# EasyEDA Pro project 搞机小队_v1.1.3.eprj, board 机身
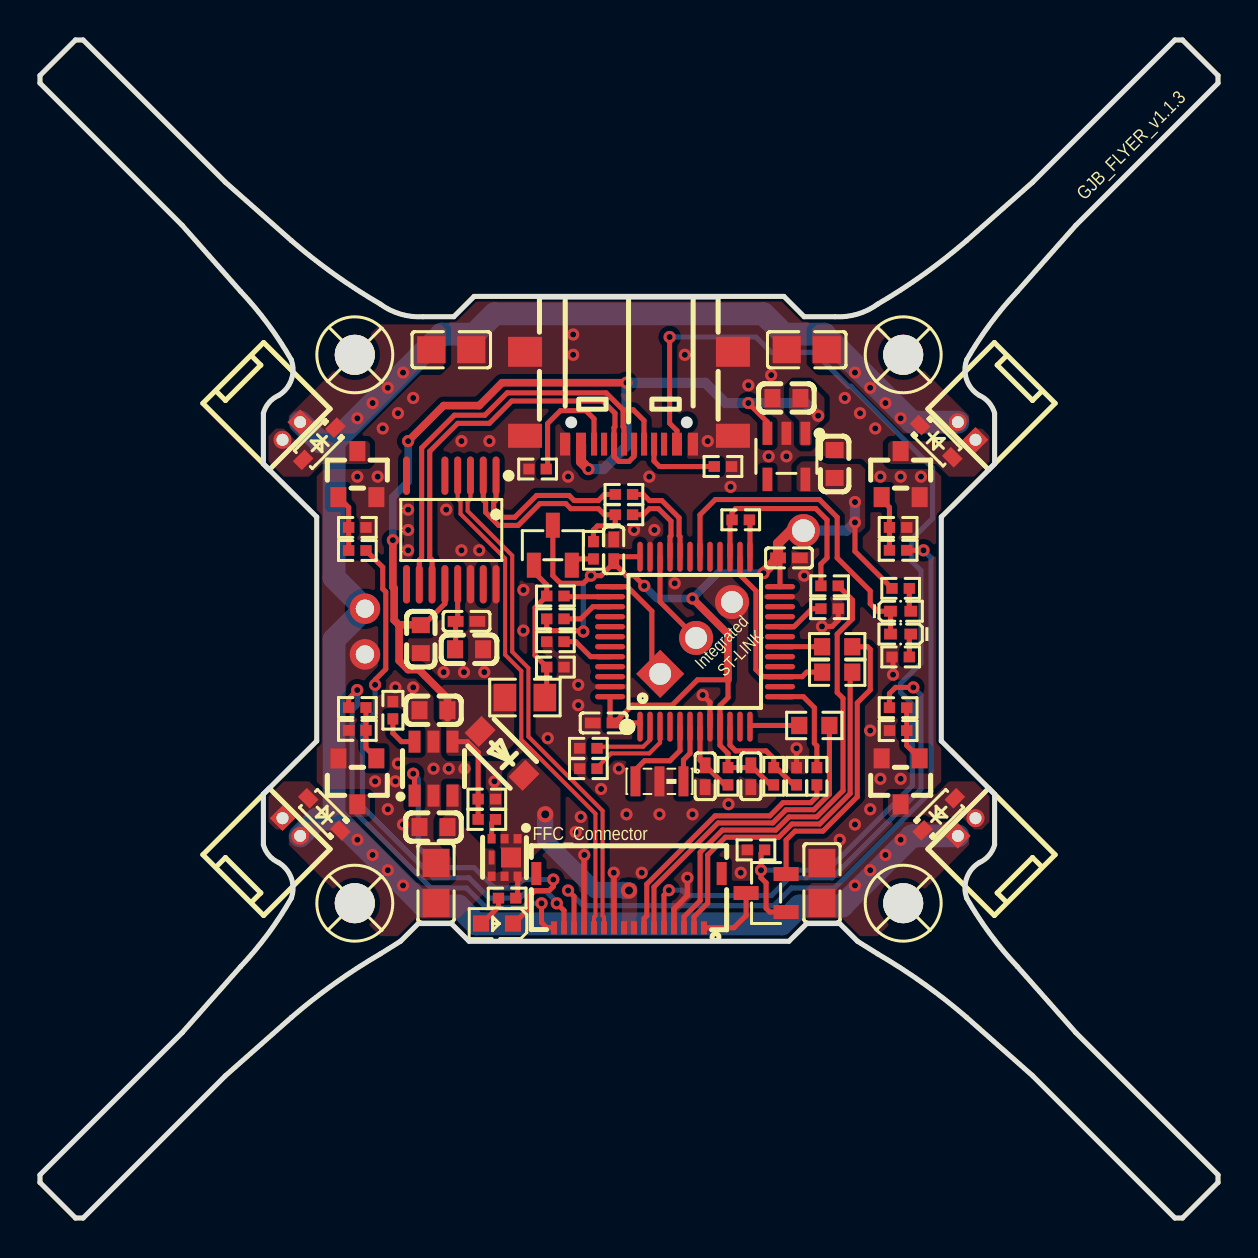
[diagram p6: board, top side]
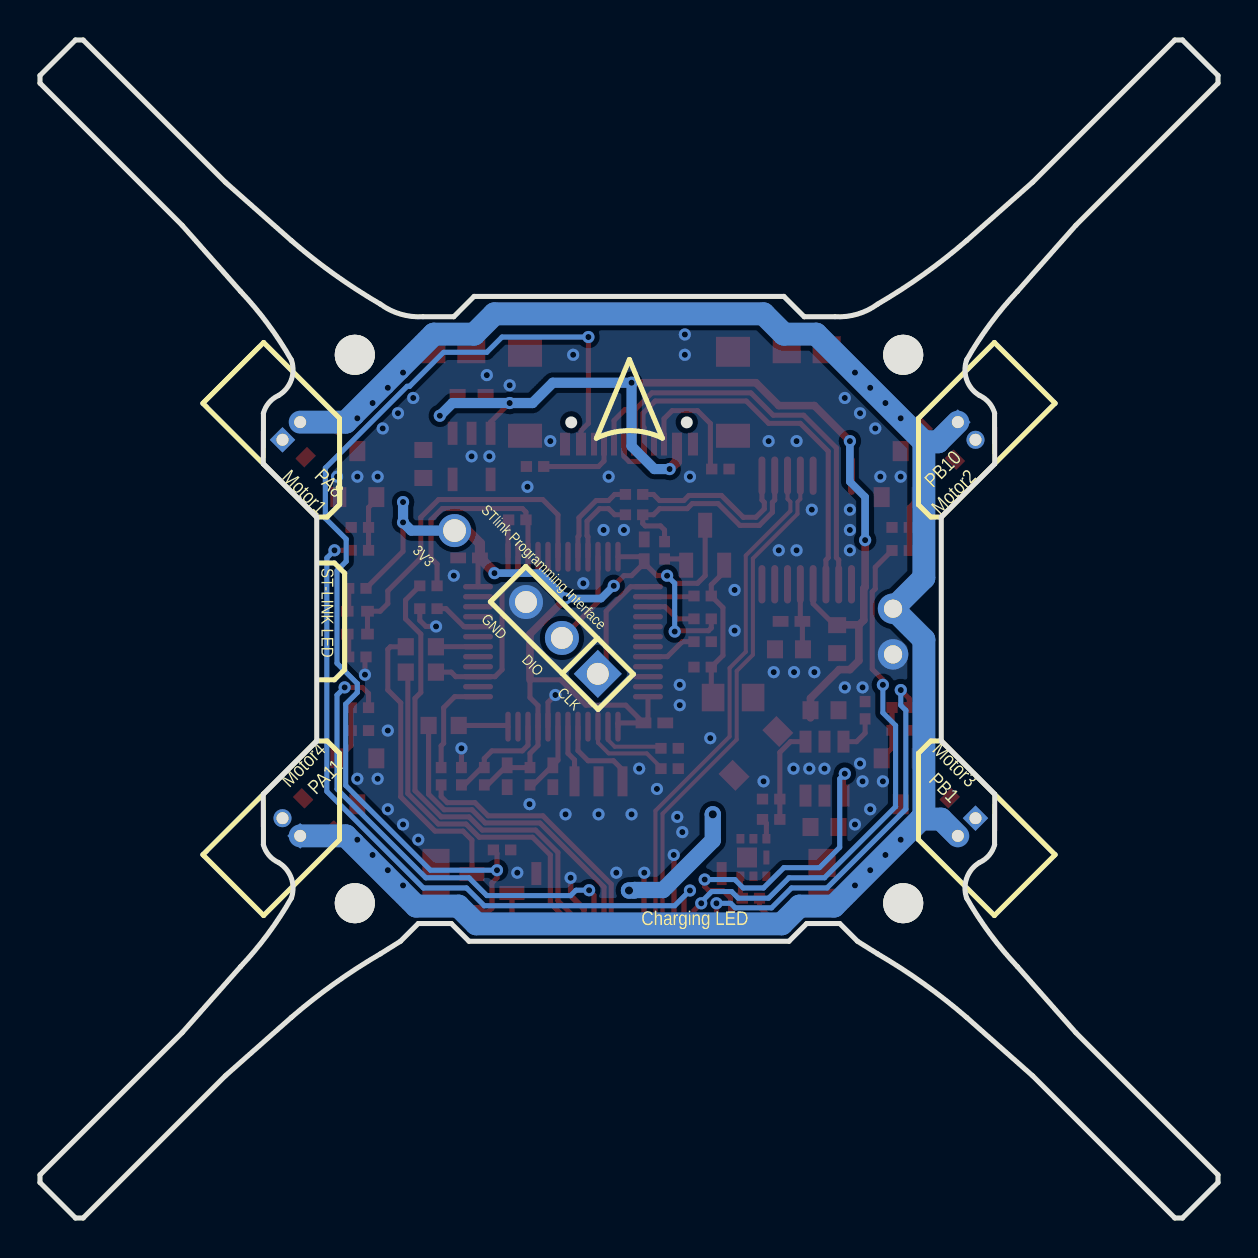
[diagram p7: board, bottom side, seen from below]

Outline 58.93 x 58.93 mm; copper layers: Top Layer, Bottom Layer. Coordinates in mm from the lower left corner of the outline.
Outline path: 0,57.15 0,56.77 7.11,49.66 10.03,46.36 arc(11.4,44.72) 12.57,42.93 arc(12.57,41.92) 11.94,41.15 arc(11.46,40.79) 11.18,40.26 11.17,37.72 13.84,35.06 13.84,23.86 11.17,21.21 11.18,18.67 arc(11.46,18.14) 11.94,17.78 arc(12.57,17) 12.57,16 arc(11.4,14.21) 10.03,12.57 7.11,9.27 0,2.16 0,1.78 1.78,0 2.16,0 9.27,7.11 12.57,10.03 arc(14.72,11.72) 17.02,13.21 18.03,13.84 18.92,14.73 20.57,14.73 21.46,13.84 37.47,13.84 38.35,14.73 40.01,14.73 40.89,13.84 41.91,13.21 arc(44.21,11.72) 46.36,10.03 49.66,7.11 56.77,0 57.15,0 58.93,1.78 58.93,2.16 51.82,9.27 48.89,12.57 arc(47.52,14.21) 46.36,16 arc(46.36,17) 46.99,17.78 arc(47.47,18.14) 47.75,18.67 47.76,21.21 45.08,23.86 45.08,35.06 47.76,37.72 47.75,40.26 arc(47.47,40.79) 46.99,41.15 arc(46.36,41.92) 46.36,42.93 arc(47.52,44.72) 48.89,46.36 51.82,49.66 58.93,56.77 58.93,57.15 57.15,58.93 56.77,58.93 49.66,51.82 46.36,48.9 arc(44.21,47.2) 41.91,45.72 arc(40.9,45.22) 39.77,45.09 38.23,45.09 37.21,46.1 21.72,46.1 20.7,45.09 19.16,45.09 arc(18.03,45.22) 17.02,45.72 arc(14.72,47.2) 12.57,48.9 9.27,51.82 2.16,58.93 1.78,58.93 0,57.15
Stack: Top Layer 0.035mm / Dielectric1 1.51mm FR4 er 4.5 / Bottom Layer 0.035mm

## Design rules (mm)
net USB_N: DP3
net USB_P: DP3
net UD3_P#: DP4
net UD3_N#: DP4
net UD4_P: DP1
net UD4_N: DP1
net USB_D-: DP2
net USB_D+: DP2
template: 自定义配置
spacing copperThickness1oz (default): track to track 0.102, other pairs 0.152 to 0.3
spacing copperThickness2oz: track to track 0.203, other pairs 0.152 to 0.3
track width copperThickness1oz (default): min 0.127, default 0.254, max 2.54
track width copperThickness2oz: min 0.203, default 0.254, max 2.54
differential pair differentialPair (default): width min 0.127, default 0.254, max 2.54; gap min 0.152, default 0.152
via viaSize (default): diameter min 0.5, default 0.61, max 10; hole min 0.3, default 0.305, max 6.3

## Placement (name value [footprint] x y rotation side)
C1  10uF  [C0603]  19.69 25.4 0 top
C2  22uF  [C0603]  19.69 19.56 0 top
C10  1uF  [C0603]  37.34 41.02 180 top
C11  1uF  [C0603]  39.75 37.72 90 top
C35  10uF  [C0603]  19.05 28.96 90 top
C36  10uF  [C0603]  21.46 28.45 180 top
C58  100nF  [C0402]  28.19 24.77 0 top
C59  100nF  [C0402]  35.56 22.1 90 top
C60  100nF  [C0402]  28.7 33.4 270 top
C61  100nF  [C0402]  37.47 33.02 180 top
C62  100nF  [C0402]  33.27 22.1 90 top
C75  100nF  [C0402]  21.34 29.85 180 top
C76  10uF  [C0805]  39.12 16.76 90 top
C77  10uF  [C0805]  19.81 16.76 90 top
C78  10uF  [C0805]  20.57 43.43 0 top
C79  10uF  [C0805]  38.35 43.43 180 top
CN8  M1250R-02P  [CONN-TH_2P-P1.25_L4.7-W4.3]  12.57 19.56 315 top
CN9  M1250R-02P  [CONN-TH_2P-P1.25_L4.7-W4.3]  46.36 39.37 135 top
CN10  M1250R-02P  [CONN-TH_2P-P1.25_L4.7-W4.3]  12.57 39.37 225 top
CN11  M1250R-02P  [CONN-TH_2P-P1.25_L4.7-W4.3]  46.36 19.56 45 top
D1  BAT54WS  [SOD-323_L1.7-W1.3-LS2.6-RD]  44.83 38.86 315 top
D2  BAT54WS  [SOD-323_L1.7-W1.3-LS2.6-RD]  44.96 20.19 45 top
D3  BAT54WS  [SOD-323_L1.7-W1.3-LS2.6-RD]  13.97 38.74 225 top
D4  BAT54WS  [SOD-323_L1.7-W1.3-LS2.6-RD]  14.22 20.19 135 top
D5  MBR120VLSFT1G  [SOD-123F_L2.8-W1.8-LS3.7-RD]  23.11 23.24 135 top
FPC1  AFC05-S16FIA-00  [FPC-SMD_16P-P0.50_AFC05-S16FIA-00]  29.46 15.88 180 top
H1  PZ254V-11-03P  [HDR-TH_3P-P2.54-V-M]  32.82 29.02 45 bottom
LED5  NCD0603Y2  [LED0603-RD]  22.86 14.73 180 top
NOREF  -  [Pad_e549]  16.26 30.48 0 top
NOREF#2  -  [Pad_e550]  16.26 28.19 0 top
NOREF#3  -  [Pad_e3017]  38.19 34.39 180 top
Q1  Si2302CDS-T1-GE3  [SOT-23_L2.9-W1.3-P1.90-LS2.4-BR]  43.05 37.21 270 top
Q2  Si2302CDS-T1-GE3  [SOT-23_L2.9-W1.3-P1.90-LS2.4-BR]  43.05 21.84 90 top
Q3  Si2302CDS-T1-GE3  [SOT-23_L2.9-W1.3-P1.90-LS2.4-BR]  15.88 37.21 270 top
Q4  Si2302CDS-T1-GE3  [SOT-23_L2.9-W1.3-P1.90-LS2.4-BR]  15.88 21.84 90 top
Q5  MMBT3904(RANGE:100-300)  [SOT-23-3_L2.9-W1.3-P1.90-LS2.4-BR]  25.65 33.66 270 top
Q9  XR25P01M  [DFN-6L_L2.0-W2.0-P0.65-BL]  23.24 18.03 180 top
R1  1.6kΩ  [R0402]  17.65 25.4 270 top
R41  22Ω  [R0603]  39.88 28.58 180 top
R44  22Ω  [R0603]  38.73 24.64 180 top
R59  10kΩ  [R0402]  25.78 28.83 180 top
R60  10kΩ  [R0402]  39.5 30.48 180 top
R61  10kΩ  [R0402]  27.43 22.48 0 top
R62  10kΩ  [R0402]  27.43 23.5 0 top
R63  10kΩ  [R0402]  34.42 22.1 90 top
R65  10kΩ  [R0402]  43.05 31.5 180 top
R66  10kΩ  [R0402]  43.05 28.07 180 top
R67  10kΩ  [R0402]  15.88 34.54 0 top
R68  10kΩ  [R0402]  15.88 24.39 180 top
R69  10kΩ  [R0402]  42.93 24.38 180 top
R70  10kΩ  [R0402]  42.93 34.54 0 top
R75  100Ω  [R0402]  35.05 34.93 0 top
R76  100Ω  [R0402]  25.78 31.12 0 top
R77  4.7kΩ  [R0402]  25.78 29.97 180 top
R78  10kΩ  [R0402]  37.85 22.1 270 top
R79  10kΩ  [R0402]  36.7 22.1 270 top
R82  22Ω  [R0402]  39.5 31.62 0 top
R85  22Ω  [R0402]  38.86 22.1 270 top
R86  10Ω  [R0402]  29.21 36.2 0 top
R87  10Ω  [R0402]  29.21 35.18 0 top
R88  1.5kΩ  [R0402]  27.69 33.4 270 top
R89  36kΩ  [R0402]  25.78 27.56 180 top
R90  100Ω  [R0402]  42.93 25.53 0 top
R91  100Ω  [R0402]  42.93 33.4 180 top
R92  100Ω  [R0402]  15.88 33.39 180 top
R93  100Ω  [R0402]  15.88 25.54 0 top
R94  5.1kΩ  [R0402]  24.89 37.47 180 top
R95  5.1kΩ  [R0402]  34.16 37.59 0 top
R96  22Ω  [R0603]  39.88 27.31 180 top
R99  10kΩ  [R0402]  23.37 16 0 top
R100  10kΩ  [R0402]  35.81 18.42 180 top
R103  10kΩ  [R0805]  24.26 26.04 180 top
R104  10kΩ  [R0402]  22.35 19.94 180 top
R105  10kΩ  [R0402]  22.35 20.96 180 top
SCREW5  -  [M2螺丝]  15.75 43.18 0 top
SCREW6  -  [M2螺丝]  15.75 15.75 0 top
SCREW7  -  [M2螺丝]  43.18 15.75 0 top
SCREW8  -  [M2螺丝]  43.18 43.18 0 top
U1  TP4059  [SOT-23-6_L2.9-W1.6-P0.95-LS2.8-BR]  19.69 22.48 270 top
U11  CH334R  [QSOP-16_L4.9-W3.9-P0.64-LS6.0-BL]  20.57 34.42 180 top
U13  STM32F103CBT6  [LQFP-48_L7.0-W7.0-P0.50-LS9.0-BL]  32.77 28.83 0 top
U14  ME6212C33M5G  [SOT-23-5_L3.0-W1.7-P0.95-LS2.8-BL]  37.34 38.1 180 top
U18  SZYY0402R  [LED0402-RD_RED]  43.05 29.21 180 top
U19  SZYY0402R  [LED0402-RD_RED]  43.05 30.35 0 top
U20  2N7002K  [SOT-23-3_L2.9-W1.3-P0.95-LS2.4-BR]  36.32 16.26 0 top
USB1  TYPE-C 16P QTWT  [USB-TYPE-C-SMD_TYPE-C-16P-QTWT]  29.46 41.02 180 top
X4  8MHz  [OSC-SMD_3P-L3.2-W1.3-P1.20]  30.99 21.84 180 top

## Footprints (pads in the part's own frame, mm; a bottom-side part is the same pattern mirrored in y, then rotated)
C0402
  rect 0.79x0.54 smd: 1(-0.545,0) 2(0.545,0)
C0603
  rect 0.8x0.9 smd: 1(-0.7,0) 2(0.7,0)
C0805
  rect 1.41x1.35 smd: 1(-1,0) 2(1,0)
CONN-TH_2P-P1.25_L4.7-W4.3
  rect 0.9x0.9 hole 0.6: 1(-0.625,0)
  round 0.9 hole 0.6: 2(0.625,0)
DFN-6L_L2.0-W2.0-P0.65-BL
  rect 0.4x0.47 smd: 1(-0.65,-0.938) 2(0,-0.938) 3(0.65,-0.938) 4(0.65,0.938) 5(0,0.938) 6(-0.65,0.938)
  rect 0.3x0.7 smd: 7(0.65,0)
  rect 1x1 smd: 8(-0.32,0)
FPC-SMD_16P-P0.50_AFC05-S16FIA-00
  rect 0.3x0.65 smd: 1(-3.75,1.355) 2(-3.25,1.355) 3(-2.75,1.355) 4(-2.25,1.355) 5(-1.75,1.355) 6(-1.25,1.355) 7(-0.75,1.355) 8(-0.25,1.355) 9(0.25,1.355) 10(0.75,1.355) 11(1.25,1.355) 12(1.75,1.355) 13(2.25,1.355) 14(2.75,1.355) 15(3.25,1.355) 16(3.75,1.355)
  rect 0.5x1.15 smd: 17(4.635,-1.355) 18(-4.635,-1.355)
HDR-TH_3P-P2.54-V-M
  rect 1.7x1.7 hole 1.1: 1(-2.54,0)
  round 1.7 hole 1.1: 2(0,0) 3(2.54,0)
LED0402-RD_RED
  rect 0.636x0.54 smd: 1(-0.508,0) 2(0.508,0)
LED0603-RD
  rect 0.8x0.8 smd: 1(-0.799,0) 2(0.799,0)
LQFP-48_L7.0-W7.0-P0.50-LS9.0-BL
  oval 0.27x1.5 smd: 1(-2.75,-4.25) 2(-2.25,-4.25) 3(-1.75,-4.25) 4(-1.25,-4.25) 5(-0.75,-4.25) 6(-0.25,-4.25) 7(0.25,-4.25) 8(0.75,-4.25) 9(1.25,-4.25) 10(1.75,-4.25) 11(2.25,-4.25) 12(2.75,-4.25) 25(2.75,4.25) 26(2.25,4.25) 27(1.75,4.25) 28(1.25,4.25) 29(0.75,4.25) 30(0.25,4.25) 31(-0.25,4.25) 32(-0.75,4.25) 33(-1.25,4.25) 34(-1.75,4.25) 35(-2.25,4.25) 36(-2.75,4.25)
  oval 1.5x0.27 smd: 13(4.25,-2.75) 14(4.25,-2.25) 15(4.25,-1.75) 16(4.25,-1.25) 17(4.25,-0.75) 18(4.25,-0.25) 19(4.25,0.25) 20(4.25,0.75) 21(4.25,1.25) 22(4.25,1.75) 23(4.25,2.25) 24(4.25,2.75) 37(-4.25,2.75) 38(-4.25,2.25) 39(-4.25,1.75) 40(-4.25,1.25) 41(-4.25,0.75) 42(-4.25,0.25) 43(-4.25,-0.25) 44(-4.25,-0.75) 45(-4.25,-1.25) 46(-4.25,-1.75) 47(-4.25,-2.25) 48(-4.25,-2.75)
M2螺丝
  round 2 hole 2: 1(0,0)
OSC-SMD_3P-L3.2-W1.3-P1.20
  rect 0.5x1.5 smd: 1(-1.2,0) 2(0,0) 3(1.2,0)
Pad_e549
  round 1.524 hole 0.914: 1(0,0)
Pad_e550
  round 1.524 hole 0.914: 1(0,0)
Pad_e3017
  round 1.651 hole 1.143: 1(0,0)
QSOP-16_L4.9-W3.9-P0.64-LS6.0-BL
  oval 0.35x1.921 smd: 1(-2.24,-2.716) 2(-1.6,-2.716) 3(-0.96,-2.716) 4(-0.32,-2.716) 5(0.32,-2.716) 8(2.24,-2.716) 9(2.24,2.716) 10(1.6,2.716) 11(0.96,2.716) 12(0.32,2.716) 13(-0.32,2.716) 14(-0.96,2.716) 15(-1.6,2.716) 16(-2.24,2.716)
R0402
  rect 0.566x0.54 smd: 1(-0.433,0) 2(0.433,0)
R0603
  rect 0.806x0.864 smd: 1(-0.753,0) 2(0.753,0)
R0805
  rect 1.133x1.377 smd: 1(-1,0) 2(1,0)
SOD-123F_L2.8-W1.8-LS3.7-RD
  rect 1x1.2 smd: 1(-1.55,0) 2(1.55,0)
SOD-323_L1.7-W1.3-LS2.6-RD
  rect 0.83x0.63 smd: 1(-1.14,0) 2(1.14,0)
SOT-23-3_L2.9-W1.3-P0.95-LS2.4-BR
  rect 1.25x0.7 smd: 1(1,-0.95) 2(1,0.95) 3(-1,0)
SOT-23-3_L2.9-W1.3-P1.90-LS2.4-BR
  rect 1.25x0.7 smd: 1(1,-0.95) 2(1,0.95) 3(-1,0)
SOT-23-5_L3.0-W1.7-P0.95-LS2.8-BL
  rect 0.49x1.157 smd: 1(-0.95,-1.153) 2(0,-1.153) 3(0.95,-1.153)
  rect 0.49x1.175 smd: 4(0.95,1.153) 5(-0.95,1.153)
SOT-23-6_L2.9-W1.6-P0.95-LS2.8-BR
  rect 1.1x0.6 smd: 1(1.35,-0.95) 2(1.35,0) 3(1.35,0.95) 4(-1.35,0.95) 5(-1.35,0) 6(-1.35,-0.95)
SOT-23_L2.9-W1.3-P1.90-LS2.4-BR
  rect 1x0.8 smd: 1(1.15,-0.95) 2(1.15,0.95) 3(-1.15,0)
USB-TYPE-C-SMD_TYPE-C-16P-QTWT
  rect 1.7x1.2 smd: 0(-5.2,1.891) 0(5.2,1.891)
  rect 1.7x1.5 smd: 0(-5.2,-2.309) 0(5.2,-2.309)
  rect 0.5x1.14 smd: A1(-3.2,2.308) A4(-2.4,2.308) A9(2.4,2.308) A12(3.2,2.308)
  rect 0.3x1.14 smd: A5(-1.25,2.308) A6(-0.25,2.308) A7(0.25,2.308) A8(1.25,2.309) B5(1.75,2.308) B6(0.75,2.308) B7(-0.75,2.308) B8(-1.75,2.309)

## Nets
As in the schematic, except:
3V3_LINK: C11.1 C58.2 C59.2 C60.2 C61.2 NOREF#3.1 Q5.3 R63.2 R65.2 R77.2 R79.2 U13.1 U13.9 U13.24 U13.36 U13.48 U14.5
GND: C1.1 C2.1 C10.2 C11.2 C35.1 C36.1 C58.1 C59.1 C60.1 C61.1 C62.1 C75.1 C76.2 C77.2 C78.2 C79.2 FPC1.4 FPC1.10 FPC1.13 H1.3 NOREF#2.1 Q1.2 Q2.2 Q3.2 Q4.2 R1.1 R59.2 R60.1 R61.1 R62.1 R66.2 R67.2 R68.2 R69.2 R70.2 R78.1 R89.1 R94.2 R95.2 R100.2 R105.1 U1.2 U1.5 U11.14 U11.16 U13.8 U13.23 U13.35 U13.47 U14.2 USB1.0 USB1.A1 USB1.A12 X4.2
NRST#: FPC1.1 U20.3
TARGET_NRST#: R41.1 U20.2
V_BAT: C2.2 C76.1 C77.1 C78.1 C79.1 CN8.2 CN9.2 CN10.1 CN11.1 D1.1 D2.1 D3.1 D4.1 NOREF.1 Q9.4 Q9.7 U1.3
V_USB_S: R100.1 U20.1 USB1.A4
$1N14380: Q5.2 R88.2
$1N14382: Q5.1 R76.1 R89.2 R103.1

Pads without a net: FPC1 17 18; SCREW5 1; SCREW6 1; SCREW7 1; SCREW8 1; U11 5 8 9 15; U13 4 11 14 16 17 19 21 22 28 29 31 40 41 42 43 45 46; U14 4; USB1 A8 B8

## Via types
v1: diameter 0.61, hole 0.305, Top Layer to Bottom Layer, 117 vias
v2: diameter 0.813, hole 0.406, Top Layer to Bottom Layer, 2 vias

## Routing (per net, layer and track width the routed paths; a pad name or vN(x,y) marks a point on that pad's centre or on a via; arc(x,y) is an arc through that point)
3V3_LINK: length 56.1
  Top Layer w0.254: v1(30.23,31.62) 29.72,32.13 29.34,32.13 28.7,32.77 ; C58.2 29.63,25.65 31.62,25.65 32.89,26.92 34.42,26.92 34.42,26.04 34.02,25.63 U13.9 34.02,23.64 34.42,23.24 R63.2 35.45,22.53 C59.2 36.54,21.67 R79.2 ; C58.2 30.02,24.77 U13.1 ; C58.2 28.52,24.99 U13.48 ; v1(27.18,29.34) 27.14,29.38 25.49,29.38 25.35,29.52 R77.2 ; 28.7,32.77 C60.2 28.92,33.08 U13.36 ; 28.7,32.77 28.07,32.13 v1(27.56,32.13) 27.18,31.75 26.04,31.75 25.65,32.13 Q5.3 ; 42.62,31.5 40.77,33.35 v1(40.77,34.8) ; 36.2,32.3 v1(36.2,32.26) ; U13.24 37.02,32.92 36.92,33.02
  Top Layer w0.381: v1(32.64,30.99) 34.42,29.21 34.42,26.92
  Top Layer w0.508: 36.2,32.3 36.92,33.02 36.92,33.75 37.56,34.39 NOREF#3.1
  Bottom Layer w0.254: v1(27.56,32.13) 27.18,31.75 v1(27.18,29.34)
  Bottom Layer w0.381: v1(30.23,31.62) 30.86,30.99 v1(32.64,30.99) 33.91,32.26 v1(36.2,32.26)
  Bottom Layer w0.508: v1(40.77,35.81) v1(40.77,34.8) 40.36,34.39 NOREF#3.1
GND: length 14.3
  Top Layer w0.254: v1(33.15,26.16) 33.52,25.79 U13.8 ; 42.62,28.07 42.67,28.02 v1(42.67,27.18) ; R60.1 39.93,29.9 39.62,29.59 v1(39.12,29.59) ; R78.1 v1(37.85,23.5)
  Top Layer w0.28: FPC1.10 28.71,17.26 ; FPC1.13 27.21,18.15 v1(27.23,18.16) ; FPC1.4 31.71,15.46 32.39,16.13 v1(32.39,17.02)
  vias: v1(15.88,37.08) v1(16.76,21.84) v1(16.89,37.08) v1(17.14,39.5) v1(17.4,20.45) v1(17.78,26.54) v1(17.78,21.84) v1(17.91,40.26) v1(17.91,22.73) v1(18.16,19.69) v1(18.42,35.43) v1(18.42,34.42) v1(18.42,33.4) v1(18.67,41.02) v1(18.67,26.54) v1(19.69,22.48) v1(20.19,27.31) v1(20.32,35.43) v1(20.45,22.48) v1(21.08,38.86) v1(21.08,33.4) v1(21.21,27.31) v1(21.23,22.48) v1(21.97,33.4) v1(22.23,27.31) v1(22.48,38.86) v1(22.73,21.84) v1(24.18,31.42) v1(24.18,29.38) v1(25.4,24) v1(26.42,37.08) v1(26.67,44.2) v1(26.67,43.18) v1(26.8,19.3) v1(26.92,26.67) v1(26.92,25.65) v1(27.05,20.07) v1(28.07,21.46) v1(28.7,17.27) v1(28.96,22.48) v1(29.34,20.19) v1(29.72,34.42) v1(30.1,17.27) v1(30.48,37.08) v1(30.73,34.42) v1(30.99,20.19) v1(31.75,31.75) v1(32.26,43.18) v1(32.64,20.19) v1(33.4,38.86) v1(34.44,20.7) v1(34.54,36.58) v1(35.05,17.27) v1(35.43,41.66) v1(36.45,38.1) v1(36.58,42.16) v1(37.34,38.1) v1(38.23,32.13) v1(40.01,18.92) v1(40.26,41.02) v1(40.77,19.69) v1(41.02,40.26) v1(41.53,24.38) v1(41.53,20.45) v1(41.78,39.5) v1(42.04,37.08) v1(42.04,21.97) v1(43.05,37.08) v1(43.05,21.97) v1(44.07,37.08)
AIN: length 5.4
  Top Layer w0.254: R78.2 37.69,21.67 36.7,22.66 ; 36.7,22.66 R79.1 ; 36.7,22.66 36.7,22.99 36.32,23.37 34.8,23.37 34.52,23.65 U13.10
CHARGE_STATE: length 16.1
  Top Layer w0.254: U1.1 18.73,22.16 v1(18.67,22.23) ; v1(25.68,16.93) 25.68,16.58 25.47,16.38 24.76,16.38 24.38,16 24.38,15.42 23.71,14.74
  Bottom Layer w0.254: v1(25.68,16.93) 24.17,16.93 23.75,16.51 22.73,16.51 21.72,17.53 19.94,17.53 18.92,18.54 18.92,21.97 v1(18.67,22.23)
LINK_NRST: length 3.6
  Top Layer w0.254: R63.1 34.25,21.67 C62.2 33.02,22.9 U13.7
LINK_RXD: length 5
  Top Layer w0.254: R85.1 38.86,23.62 38.73,23.75 38.73,25.53 38.18,26.08 U13.13
LINK_SCLK: length 5.9
  Top Layer w0.254: U13.37 29.38,31.58 30.61,30.35 30.61,27.64 H1.1
LINK_SDIO: length 4.8
  Top Layer w0.254: H1.2 31.02,30.82 U13.34
LINK_TXD: length 2.5
  Top Layer w0.254: U13.12 35.58,24.64 R44.2
MOTOR1#: length 35.9
  Top Layer w0.254: v1(26.42,16.38) 26.71,16.09 FPC1.14 ; R91.1 v1(44.2,33.4)
  Bottom Layer w0.254: v1(44.2,33.4) 44.58,33.02 44.58,21.34 39.75,16.51 37.59,16.51 36.7,15.62 27.18,15.62 v1(26.42,16.38)
MOTOR2#: length 27.1
  Top Layer w0.254: FPC1.15 26.21,15.38 v1(25.85,15.74) ; R92.1 17.14,32.55 17.14,31.47 17.3,31.32 17.3,27.46 16.76,26.92 v1(16.76,26.67)
  Bottom Layer w0.254: v1(16.76,26.67) 16.76,25.27 16.13,24.64 16.13,20.57 19.69,17.02 21.46,17.02 22.48,16 24,16 24.33,16.33 25.32,16.33 25.85,15.8 v1(25.85,15.74)
MOTOR3#: length 20.4
  Top Layer w0.254: R93.1 15.44,25.98 v1(15.87,26.41) ; FPC1.16 25.35,14.52 25.09,14.79 v1(25.09,15.74)
  Bottom Layer w0.254: v1(25.09,15.74) 24.38,15.74 24.15,15.52 22.33,15.52 21.34,16.51 19.56,16.51 15.61,20.45 15.61,25.39 15.87,25.65 v1(15.87,26.41)
MOTOR4#: length 24.2
  Top Layer w0.254: v1(31.46,16.4) 31.21,16.15 FPC1.5 ; R90.1 42.49,26.24 42.8,26.54 v1(43.69,26.54)
  Bottom Layer w0.254: v1(31.46,16.4) 32.12,16.4 32.39,16.13 36.58,16.13 37.47,17.02 39.63,17.02 44.07,21.46 44.07,26.16 v1(43.69,26.54)
NRST#: length 3.5
  Top Layer w0.254: U20.3 35.32,15.13 34.71,14.52 FPC1.1
POWER#: length 7.7
  Top Layer w0.254: R99.2 23.89,16.09 Q9.6
  Bottom Layer w0.813: v2(29.46,16.38) 29.21,16.38 29.18,16.41 27.76,16.41 25.27,18.89 v2(25.27,20.19)
STM_RXD1#: length 16.2
  Top Layer w0.254: FPC1.6 30.71,16.56 33.92,19.76 36.66,19.76 37.32,20.42 38.71,20.42 39.49,21.2 R44.1
STM_SWCLK#: length 18.4
  Top Layer w0.254: R96.1 40.53,27.2 40.53,21.23 39.01,19.71 37.62,19.71 36.96,19.05 34.29,19.05 33.4,18.16 33.4,15.75 32.71,15.06 FPC1.2
STM_SWDIO#: length 23.5
  Top Layer w0.254: R82.2 40.64,30.91 40.64,29.97 39.88,29.21 39.88,26.29 40.17,26 40.17,21.38 38.86,20.07 37.47,20.07 36.8,19.41 34.14,19.41 33.02,18.29 33.02,15.88 32.21,15.07 FPC1.3
STM_TXD1#: length 13.1
  Top Layer w0.254: R85.2 38.86,21.08 38.56,20.78 37.17,20.78 36.51,20.12 33.77,20.12 30.35,16.7 30.35,15.11 30.21,14.97 FPC1.7
TARGET_LED: length 17
  Top Layer w0.254: U13.30 33.02,35.18 33.78,35.94 38.99,35.94 39.88,35.05 39.88,33.02 41.53,31.37 41.53,30.73 41.91,30.35 U19.1 U18.2
TARGET_NRST: length 2.1
  Top Layer w0.254: U13.18 39.12,28.58 R41.2
TARGET_NRST#: length 14.8
  Top Layer w0.254: 37.32,17.21 37.32,18.91 37.77,19.35 39.17,19.35 40.88,21.07 40.88,25.77 41.53,26.42 41.53,28.45 41.4,28.58 R41.1
TARGET_SCLK: length 9.5
  Top Layer w0.254: R96.2 38.35,27.31 38.13,27.08 U13.15 36.17,27.08 35.81,27.43 35.81,31.37 35.02,32.17 U13.26
TARGET_SDIO: length 10.8
  Top Layer w0.254: U13.27 34.52,34.82 R75.1 34.62,35.31 34.8,35.49 38.8,35.49 39.37,34.93 39.37,33.02 39.06,32.71 R82.1
UD3_N#: length 25.5
  Top Layer w0.203: U11.3 21.53,35.97 21.39,35.83 21.39,35.37 23.62,33.14 23.62,28.32 24.43,27.51 24.43,24.08 28.14,20.37 28.14,15.12 28.21,15.05 FPC1.11
UD3_P#: length 25.5
  Top Layer w0.203: FPC1.12 27.71,15.05 27.79,15.12 27.79,20.23 24.08,23.93 24.08,27.36 23.27,28.17 23.27,32.99 21.04,35.22 21.04,35.83 20.89,35.97 U11.4
UD4_N: length 8.6
  Top Layer w0.254: R86.1 28.24,36.2 27.94,35.89 26.72,35.89 26.47,36.14 24.84,36.14 23.75,35.05 23.11,35.05 22.7,35.47 22.7,35.8 22.81,35.92 U11.1
UD4_P: length 11.6
  Top Layer w0.254: U11.2 22.17,35.92 22.29,35.8 22.29,35.3 22.95,34.65 23.92,34.65 25.01,35.74 26.3,35.74 26.55,35.48 27.94,35.48 28.24,35.18 R87.1 28.78,34.75 28.65,34.62 27.89,34.62 27.69,34.42 27.69,33.83
USB_D+: length 4.1
  Top Layer w0.254: R87.2 30.18,35.18 30.48,35.48 30.94,35.48 31.56,34.86 31.56,34.13 31.52,34.08 U13.33
USB_D-: length 4.8
  Top Layer w0.254: U13.32 32.02,34.08 31.97,34.13 31.97,35.03 31.11,35.89 30.48,35.89 30.18,36.2 R86.2
USB_ENUM: length 2.3
  Top Layer w0.254: U13.38 26.25,31.08 26.21,31.12
USB_N: length 22.6
  Top Layer w0.254: 29.17,40.43 29.68,40.43 30.21,39.89 USB1.B7 ; 29.17,40.43 29.17,39.58 29.21,39.54 USB1.A7 ; 29.17,40.43 28.32,41.28 23.37,41.28 22.25,40.16 20.73,40.16 19.09,38.52 19.09,33.03 18.97,32.92 U11.10
USB_P: length 21.3
  Top Layer w0.254: U11.11 19.61,32.92 19.5,33.03 19.5,38.35 20.89,39.75 22.48,39.75 23.6,40.87 28.15,40.87 28.76,40.26 28.76,39.58 28.71,39.54 USB1.B6 28.71,38.09 28.96,37.85 29.46,37.85 29.71,38.1 USB1.A6
V_BAT: length 95.7
  Bottom Layer w1.143: 14.71,38.83 14.71,32.02 NOREF.1 14.71,28.94 14.71,20.1 14.86,19.96 ; 14.71,38.83 14,38.83 13.02,39.81 ; 14.71,38.83 20.1,44.21 21.72,44.21 22.73,45.23 36.19,45.23 37.21,44.21 39.23,44.21 43.63,39.81 45.91,39.81 ; 14.86,19.96 13.86,19.96 CN8.2 ; 14.86,19.96 19.21,15.6 20.94,15.6 21.82,14.71 37.1,14.71 37.99,15.6 40.11,15.6 43.63,19.12 CN11.1
  vias: v1(15.88,40.01) v1(15.88,18.92) v1(16.64,40.77) v1(16.64,18.16) v1(17.4,41.53) v1(17.4,17.4) v1(18.16,42.29) v1(18.16,16.64) v1(40.77,42.29) v1(40.77,16.64) v1(41.53,41.53) v1(41.53,17.4) v1(42.29,40.77) v1(42.29,18.16) v1(43.05,40.01) v1(43.05,18.92)
V_USB: length 55.6
  Top Layer w0.254: 19.05,29.53 20.25,30.73 U11.12 ; R104.2 R105.2 21.92,23.29 21.38,23.83 U1.4 ; v1(35.43,40.77) 36.39,39.81 36.39,39.25
  Top Layer w0.381: 17.95,29.68 17.72,29.91 17.72,31.49 17.65,31.56 v1(17.65,33.91) ; 17.95,29.68 18.9,29.68 19.05,29.53 ; 17.95,29.68 17.96,29.66 17.96,27.88 18.41,27.43 18.95,27.43 20.39,26 20.39,25.02 ; v1(29.34,41.78) 23.11,41.78 21.97,40.64 20.19,40.64 v1(18.42,38.86)
  Top Layer w0.508: USB1.A9 27.06,37.83 v1(27.43,37.47)
  Bottom Layer w0.381: v1(18.42,38.86) 18.42,36.83 17.65,36.07 v1(17.65,33.91)
  Bottom Layer w0.508: v1(38.93,40.13) 38.29,40.77 v1(35.43,40.77) 34.29,40.77 33.27,41.78 v1(29.34,41.78) 29.34,38.61 28.19,37.47 v1(27.43,37.47)
V_USB_S: length 52
  Top Layer w0.254: U20.1 36.51,15.31 36.32,15.49 36.32,16.76 36.07,17.02 v1(36.07,17.4) 36.07,18.24 R100.1 ; 31.86,38.71 31.86,39.38 31.5,39.75 v1(31.5,44.07)
  Bottom Layer w0.254: v1(36.07,17.4) 39.39,17.4 43.64,21.64 43.64,25.71 43.05,26.29 43.05,26.73 44.07,27.75 44.07,32.39 43.61,32.84 43.61,33.96 44.65,35 44.65,37.52 40.56,41.61 40.44,41.61 38.73,43.31 36.58,43.31 35.81,44.07 v1(31.5,44.07)
$1N7740: length 2
  Top Layer w0.254: U1.6 18.08,23.83 17.65,24.26 R1.2
$1N7744: length 2.9
  Top Layer w0.254: R92.2 R67.1 15.44,35.54 Q3.1
$1N7749: length 2.8
  Top Layer w0.254: R93.2 R68.1 16.31,23.51 Q4.1
$1N7758: length 2.7
  Top Layer w0.254: R91.2 R70.1 42.49,35.54 42.1,35.93
$1N7762: length 2.8
  Top Layer w0.254: R90.2 R69.1 43.36,23.64 Q2.1
$1N8298: length 4
  Top Layer w0.254: R95.1 30.99,37.59 30.71,37.87 USB1.A5
$1N8323: length 6.4
  Top Layer w0.254: R94.1 25.39,37.47 25.39,39.74 26.04,40.39 27.3,40.39 27.71,39.98 USB1.B5
$1N9080: length 3.3
  Top Layer w0.254: C36.2 20.79,28.48 C75.2 20.89,29.95 U11.13
$1N14297: length 3.5
  Top Layer w0.203: R62.2 27.95,23.58 30.18,23.58 30.52,23.91 U13.2
$1N14298: length 4.5
  Top Layer w0.203: U13.3 31.02,23.78 30.48,23.24 28.58,23.24 27.86,22.53 R61.2
$1N14300: length 4.4
  Top Layer w0.254: 29.79,21.84 29.79,22.42 30.24,22.87 31.51,22.87 32.02,23.38 U13.5
$1N14302: length 2.9
  Top Layer w0.254: U13.6 32.52,23.25 32.19,22.92 X4.1
$1N14357: length 1.9
  Top Layer w0.254: U13.25 35.52,34.89 R75.2
$1N14363: length 2.7
  Top Layer w0.254: U13.44 27.55,28.08 26.8,28.83 26.34,28.83 26.21,28.7
$1N14365: length 2.6
  Top Layer w0.254: U13.39 27.66,30.58 27.05,29.97 26.21,29.97
$1N14380: length 1.2
  Top Layer w0.254: Q5.2 26.92,32.97 R88.2
$1N14382: length 7.4
  Top Layer w0.254: 24.7,32.66 24.7,32.32 25.35,31.68 R76.1 24.77,30.53 24.77,28.14 R89.2 25.35,26.13 R103.1
$1N53040: length 2.4
  Top Layer w0.254: U13.20 37.72,29.58 38.62,30.48 R60.2
$1N53317: length 1.2
  Top Layer w0.254: U18.1 43.49,29.13 R66.1
$1N67321: length 1.2
  Top Layer w0.254: U19.2 43.49,30.43 R65.1
$1N110093: length 1.6
  Top Layer w0.254: R99.1 22.94,15.56 22.11,14.74
$1N132481: length 1
  Top Layer w0.254: R104.1 22.59,19.75 Q9.3

## Copper pours and planes (outline as drawn; the poured copper is in the pictures)
3V3_LINK on Top Layer: 37.97,36.32 37.85,36.45 37.85,37.59 38.1,37.85 39.24,37.85 39.37,37.72 41.02,37.72 41.27,37.47 41.27,34.54 41.02,34.29 40.51,34.29 40.26,34.54 40.26,35.18 39.12,36.32
GND on Top Layer: 17.53,26.92 17.14,26.54 17.14,25.65 17.27,25.53 18.03,25.53 18.92,24.64 19.05,24.64 19.3,24.38 19.3,20.57 19.05,20.32 18.16,20.32 17.91,20.07 17.91,18.16 19.18,16.89 20.45,16.89 20.57,17.02 20.57,18.03 19.69,18.92 19.69,19.94 20.07,20.32 20.07,24.64 19.69,25.02 19.69,26.04 18.8,26.92
GND on Top Layer: 45.08,17.65 41.27,13.84 17.65,13.84 13.84,17.65 13.84,41.28 17.65,45.09 20.7,45.09 21.72,46.1 37.21,46.1 38.23,45.09 41.27,45.09 45.08,41.28
GND on Top Layer: 18.67,35.69 18.67,33.02 18.29,33.02 17.91,33.4 17.91,34.29 17.78,34.42 17.27,34.42 17.14,34.54 17.4,34.8 17.4,35.81 17.65,36.07 17.91,36.07 18.16,35.81 18.54,35.81
GND on Top Layer: 14.22,23.11 14.1,23.24 14.1,32.39 14.35,32.64 16.64,32.64 16.89,32.39 16.89,27.56 16.26,26.92 15.62,26.92 14.99,26.29 14.99,25.15 15.24,24.89 15.62,24.89 15.75,24.77 15.75,23.11
GND on Top Layer: 20.7,35.56 20.45,35.81 20.07,35.81 19.94,35.69 19.94,33.4 20.32,33.02 20.95,33.02 21.21,32.77 21.21,30.48 21.46,30.23 22.86,30.23 22.99,30.35 22.99,32.89 20.7,35.18
GND on Top Layer: 39.88,16.89 38.61,16.89 38.35,17.15 38.35,18.67 38.61,18.92 39.24,18.92 41.27,20.96 41.27,24.77 41.53,25.02 42.67,25.02 42.8,24.89 42.8,23.62 43.31,23.11 43.31,22.35 43.56,22.1 43.56,21.72 43.31,21.46 42.55,21.46 42.16,21.08 42.16,19.18
GND on Top Layer: 18.42,28.58 18.67,28.83 19.56,28.83 19.94,28.45 19.94,27.81 20.19,27.56 21.21,27.56 21.59,27.94 21.59,29.21 21.46,29.34 21.46,30.23 21.72,30.48 22.23,30.48 22.48,30.73 22.48,32.89 22.61,33.02 22.99,33.02 22.99,27.31 22.61,26.92 20.07,26.92 19.18,27.81 18.67,27.81 18.42,28.07
GND on Top Layer: 14.35,23.62 15.62,23.62 16,23.24 16,22.61 16.38,22.23 17.27,22.23 17.53,22.48 17.53,23.11 17.65,23.24 18.16,23.24 18.29,23.11 19.43,23.11 19.43,22.61 18.42,22.61 18.16,22.35 18.16,20.57 18.54,20.19 18.54,18.03 18.03,18.03 16.76,19.3 16.76,21.21 16.51,21.46 14.61,21.46 14.1,21.97 14.1,23.37
GND on Top Layer: 17.91,34.93 17.14,34.16 16.13,34.16 16.13,34.17 16,34.29 16,36.2 15.49,36.7 15.49,37.34 15.62,37.47 16.51,37.47 16.76,37.72 16.76,39.88 19.05,42.16 20.07,42.16 20.57,42.67 20.57,44.45 21.84,45.72 29.85,45.72 29.85,42.55 28.83,42.55 28.45,42.16 22.86,42.16 21.84,41.15 20.07,41.15 17.91,38.99
GND on Bottom Layer: 45.08,17.65 41.27,13.84 17.65,13.84 13.84,17.65 13.84,41.28 17.65,45.09 20.7,45.09 21.72,46.1 37.21,46.1 38.23,45.09 41.27,45.09 45.08,41.28
POWER# on Top Layer: 29.06,14.2 29.06,16.61 29.21,16.76 29.72,16.76 29.87,16.61 29.87,14.2
POWER# on Top Layer: 24.13,22.99 24.57,22.99 26.04,21.52 26.04,19.05 25.78,18.8 25.4,18.8 24.38,17.78 24.38,16.89 24.26,16.76 22.99,16.76 22.99,19.43 23.37,19.81 23.37,22.23
V_BAT on Top Layer: 38.61,16.76 38.23,16.38 38.23,15.11 38.35,14.99 40.13,14.99 41.02,14.1 41.91,14.1 46.48,18.67 46.48,19.18 45.85,19.81 43.18,19.81 40.13,16.76
V_BAT on Top Layer: 45.85,39.24 46.48,39.88 46.48,40.13 41.91,44.7 38.86,44.7 38.61,44.45 38.61,42.8 38.99,42.42 40.01,42.42 43.18,39.24
V_BAT on Top Layer: 20.32,16.76 20.7,16.38 20.7,15.11 20.57,14.99 18.8,14.99 17.91,14.1 17.02,14.1 12.45,18.67 12.45,19.18 13.08,19.81 15.75,19.81 18.8,16.76
V_BAT on Top Layer: 20.57,14.99 20.19,15.37 20.19,16.64 20.7,17.15 20.7,18.29 19.81,19.18 19.81,20.07 20.19,20.45 20.19,21.59 20.32,21.72 20.95,21.72 21.08,21.59 21.08,19.69 22.23,18.54 22.61,18.54 22.86,18.29 22.86,16.89 20.95,14.99
V_BAT on Top Layer: 13.08,39.24 12.45,39.88 12.45,40.13 17.02,44.7 20.07,44.7 20.32,44.45 20.32,42.8 19.94,42.42 18.92,42.42 15.75,39.24
V_USB on Top Layer: 19.94,26.42 20.19,26.67 23.62,26.67 23.75,26.54 23.75,23.75 23.11,23.11 20.45,23.11 20.32,23.24 20.32,24.64 19.94,25.02
V_USB on Top Layer: 38.1,38.61 38.48,38.61 38.61,38.74 38.61,39.37 39.24,40.01 39.24,41.02 38.48,41.78 37.72,41.78 37.47,41.53 37.47,40.39 37.97,39.88 37.97,38.74
$1N7745 on Top Layer: 12.19,39.5 12.83,38.86 16.38,38.86 16.51,38.74 16.51,37.85 16.38,37.72 14.1,37.72 13.46,37.08 12.19,37.08 11.43,37.85 11.43,39.12 11.81,39.5
$1N7748 on Top Layer: 12.19,19.43 12.83,20.07 16.38,20.07 16.51,20.19 16.51,21.08 16.38,21.21 14.1,21.21 13.46,21.84 12.19,21.84 11.43,21.08 11.43,19.81 11.81,19.43
$1N7759 on Top Layer: 46.74,39.5 46.1,38.86 42.55,38.86 42.42,38.74 42.42,37.85 42.55,37.72 44.83,37.72 45.47,37.08 46.74,37.08 47.5,37.85 47.5,39.12 47.12,39.5
$1N7764 on Top Layer: 46.74,19.43 46.1,20.07 42.55,20.07 42.42,20.19 42.42,21.08 42.55,21.21 44.83,21.21 45.47,21.84 46.74,21.84 47.5,21.08 47.5,19.81 47.12,19.43

## Text on the board
Bottom Silkscreen Layer: CLK | DIO | STlink Programming Interface | GND | 3V3 | ST-LINK LED | Motor3 / PB1 | PB10 / Motor2 | Motor4 / PA11 | PA8 / Motor1 | Charging LED
Top Silkscreen Layer: Integrated / ST-LINK | FFC_Connector | GJB_FLYER_v1.1.3
